# Altium schematic sheet pmic_tps79933.SchDoc
size A
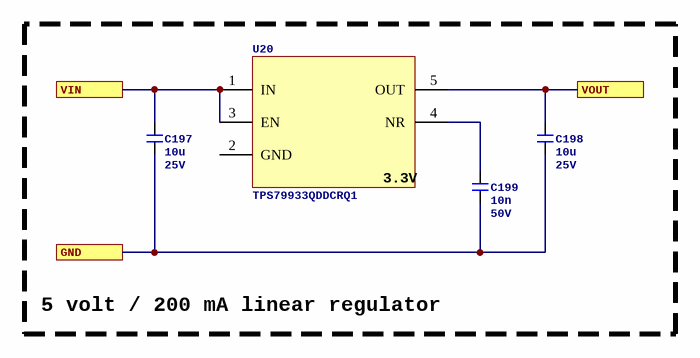
[diagram p0: pmic_tps79933.SchDoc]

## Parts
C197  Capacitance: 10u  Voltage Rating: 25V  [C0805]  (hidden comment: CL21B106KAYQNNE)
C198  Capacitance: 10u  Voltage Rating: 25V  [C0805]  (hidden comment: CL21B106KAYQNNE)
C199  Capacitance: 10n  Voltage Rating: 50V  [C0402]  (hidden comment: CL05B103KB5NNNC)
U20  TPS79933QDDCRQ1  [5SOT23]

## Blocks framed on the sheet
5 volt / 200 mA linear regulator: C197-C199 U20

## Ports
GND, VIN, VOUT

## Nets
GND: C197.2 C198.2 C199.2 ; port GND
VIN: C197.1 U20.1(IN) U20.3(EN) ; port VIN
VOUT: C198.1 U20.5(OUT) ; port VOUT
NetC199_1: C199.1 U20.4(NR)

Not connected (* = marked no-connect by the designer): U20 2(GND)

## Notes on the sheet
- (in symbol LDO_TPS79933QDDCRQ1) 3.3V

## Library data of the parts
C197 C198 = CL21B106KAYQNNE: Manufacturer: Samsung Electro-Mechanics; Dielectric: X7R; ComponentLink1URL: https://datasheet.lcsc.com/lcsc/2206222030_Samsung-Electro-Mechanics-CL21B106KAYQNNE_C3039694.pdf; ComponentLink1Description: Datasheet; Manufacturer Part Number: CL21B106KAYQNNE; Package: 0805; Supplier 2: LCSC; Supplier Part Number 2: C3039694
C199 = CL05B103KB5NNNC: Manufacturer: Samsung Electro-Mechanics; Dielectric: X7R; ComponentLink1URL: https://wmsc.lcsc.com/wmsc/upload/file/pdf/v2/lcsc/2304140030_Samsung-Electro-Mechanics-CL05B103KB5NNNC_C15195.pdf; ComponentLink1Description: Datasheet; Manufacturer Part Number: CL05B103KB5NNNC; Package: 0402; Supplier 2: LCSC; Supplier Part Number 2: C15195
U20 = LDO_TPS79933QDDCRQ1: Fixed Positive LDO Regulator, 3.3V, 0.16V Dropout, BICMOS, PDSO5; Manufacturer: Texas Instruments; Supplier 1: Digikey; Supplier Part Number 1: 296-24852-1-ND; Manufacturer Part Number: TPS79933QDDCRQ1; RoHS Compliant: Yes; ComponentLink1Description: Datasheet; ComponentLink1URL: https://www.ti.com/lit/ds/symlink/tps799-q1.pdf; Supplier 2: LCSC; Supplier Part Number 2: C2865613